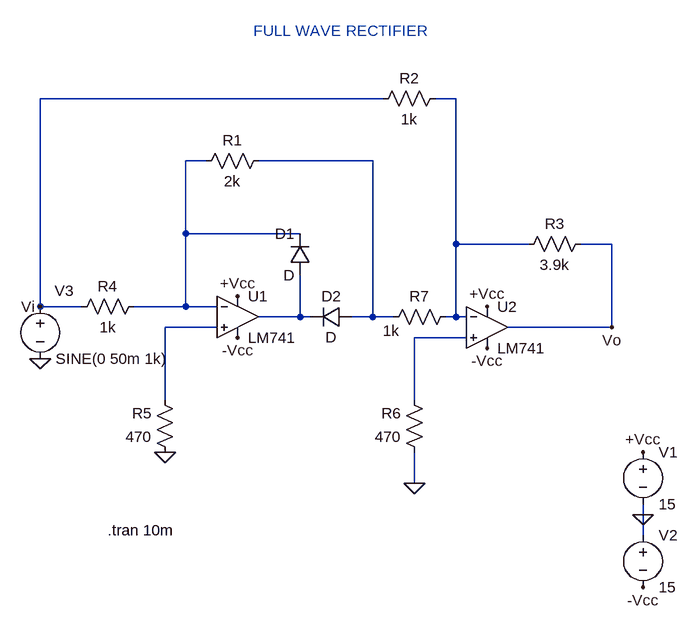
[diagram p0: schematic Fullwave.asc]
Fullwave.asc, the LTspice schematic file:
Version 4
SHEET 1 880 680
WIRE 240 -304 -288 -304
WIRE 352 -304 320 -304
WIRE -32 -208 -64 -208
WIRE 224 -208 48 -208
WIRE -64 -96 -64 -208
WIRE 112 -96 -64 -96
WIRE 352 -80 352 -304
WIRE 464 -80 352 -80
WIRE 592 -80 544 -80
WIRE -288 16 -288 -304
WIRE -224 16 -288 16
WIRE -64 16 -64 -96
WIRE -64 16 -144 16
WIRE -16 16 -64 16
WIRE 112 32 112 -32
WIRE 112 32 48 32
WIRE 128 32 112 32
WIRE 224 32 224 -208
WIRE 224 32 192 32
WIRE 256 32 224 32
WIRE 352 32 352 -80
WIRE 352 32 336 32
WIRE 368 32 352 32
WIRE -16 48 -96 48
WIRE 592 48 592 -80
WIRE 592 48 432 48
WIRE 368 64 288 64
WIRE -96 160 -96 48
WIRE 288 160 288 64
WIRE 288 288 288 240
WIRE 640 336 640 320
WIRE 640 368 640 336
FLAG -288 96 0
FLAG 640 336 0
FLAG -96 240 0
FLAG 288 288 0
FLAG 16 0 +Vcc
FLAG 16 64 -Vcc
FLAG 400 16 +Vcc
FLAG 640 240 +Vcc
FLAG 400 80 -Vcc
FLAG 640 448 -Vcc
FLAG 592 48 Vo
FLAG -288 16 Vi
SYMBOL Opamps\\LM741 16 -32 R0
SYMATTR InstName U1
SYMATTR SpiceModel ""
SYMBOL Opamps\\LM741 400 -16 R0
SYMATTR InstName U2
SYMATTR SpiceModel ""
SYMBOL diode 128 -32 R180
WINDOW 0 24 64 Left 2
WINDOW 3 24 0 Left 2
SYMATTR InstName D1
SYMBOL diode 192 16 R90
WINDOW 0 0 32 VBottom 2
WINDOW 3 32 32 VTop 2
SYMATTR InstName D2
SYMBOL res 64 -224 R90
WINDOW 0 0 56 VBottom 2
WINDOW 3 32 56 VTop 2
SYMATTR InstName R1
SYMATTR Value 2k
SYMBOL res 336 -320 R90
WINDOW 0 0 56 VBottom 2
WINDOW 3 32 56 VTop 2
SYMATTR InstName R2
SYMATTR Value 1k
SYMBOL res 560 -96 R90
WINDOW 0 0 56 VBottom 2
WINDOW 3 32 56 VTop 2
SYMATTR InstName R3
SYMATTR Value 3.9k
SYMBOL res -128 0 R90
WINDOW 0 0 56 VBottom 2
WINDOW 3 32 56 VTop 2
SYMATTR InstName R4
SYMATTR Value 1k
SYMBOL res -80 256 R180
WINDOW 0 36 76 Left 2
WINDOW 3 36 40 Left 2
SYMATTR InstName R5
SYMATTR Value 470
SYMBOL res 304 256 R180
WINDOW 0 36 76 Left 2
WINDOW 3 36 40 Left 2
SYMATTR InstName R6
SYMATTR Value 470
SYMBOL res 352 16 R90
WINDOW 0 0 56 VBottom 2
WINDOW 3 22 100 VTop 2
SYMATTR InstName R7
SYMATTR Value 1k
SYMBOL voltage 640 224 R0
SYMATTR InstName V1
SYMATTR Value 15
SYMBOL voltage 640 352 R0
SYMATTR InstName V2
SYMATTR Value 15
SYMBOL voltage -288 0 R0
WINDOW 0 22 -8 Left 2
WINDOW 123 0 0 Left 2
WINDOW 39 0 0 Left 2
SYMATTR InstName V3
SYMATTR Value SINE(0 50m 1k)
TEXT 40 -408 Left 2 ;FULL WAVE RECTIFIER
TEXT -184 360 Left 2 !.tran 10m

The netlist it stands for:
* Fullwave.asc
XU1 N005 N002 +Vcc -Vcc N004 LM741  ; pins In+ In- V+ V- OUT
XU2 N006 N001 +Vcc -Vcc Vo LM741  ; pins In+ In- V+ V- OUT
D1 N004 N002 D
D2 N003 N004 D
R1 N003 N002 2k
R2 N001 Vi 1k
R3 Vo N001 3.9k
R4 N002 Vi 1k
R5 0 N005 470
R6 0 N006 470
R7 N001 N003 1k
V1 +Vcc 0 15
V2 0 -Vcc 15
V3 Vi 0 SINE(0 50m 1k)
.model D D
.lib standard.dio
* FULL WAVE RECTIFIER
.tran 10m
.lib LM741.lib
.backanno
.end